# Altium schematic sheet main.schdoc
size B
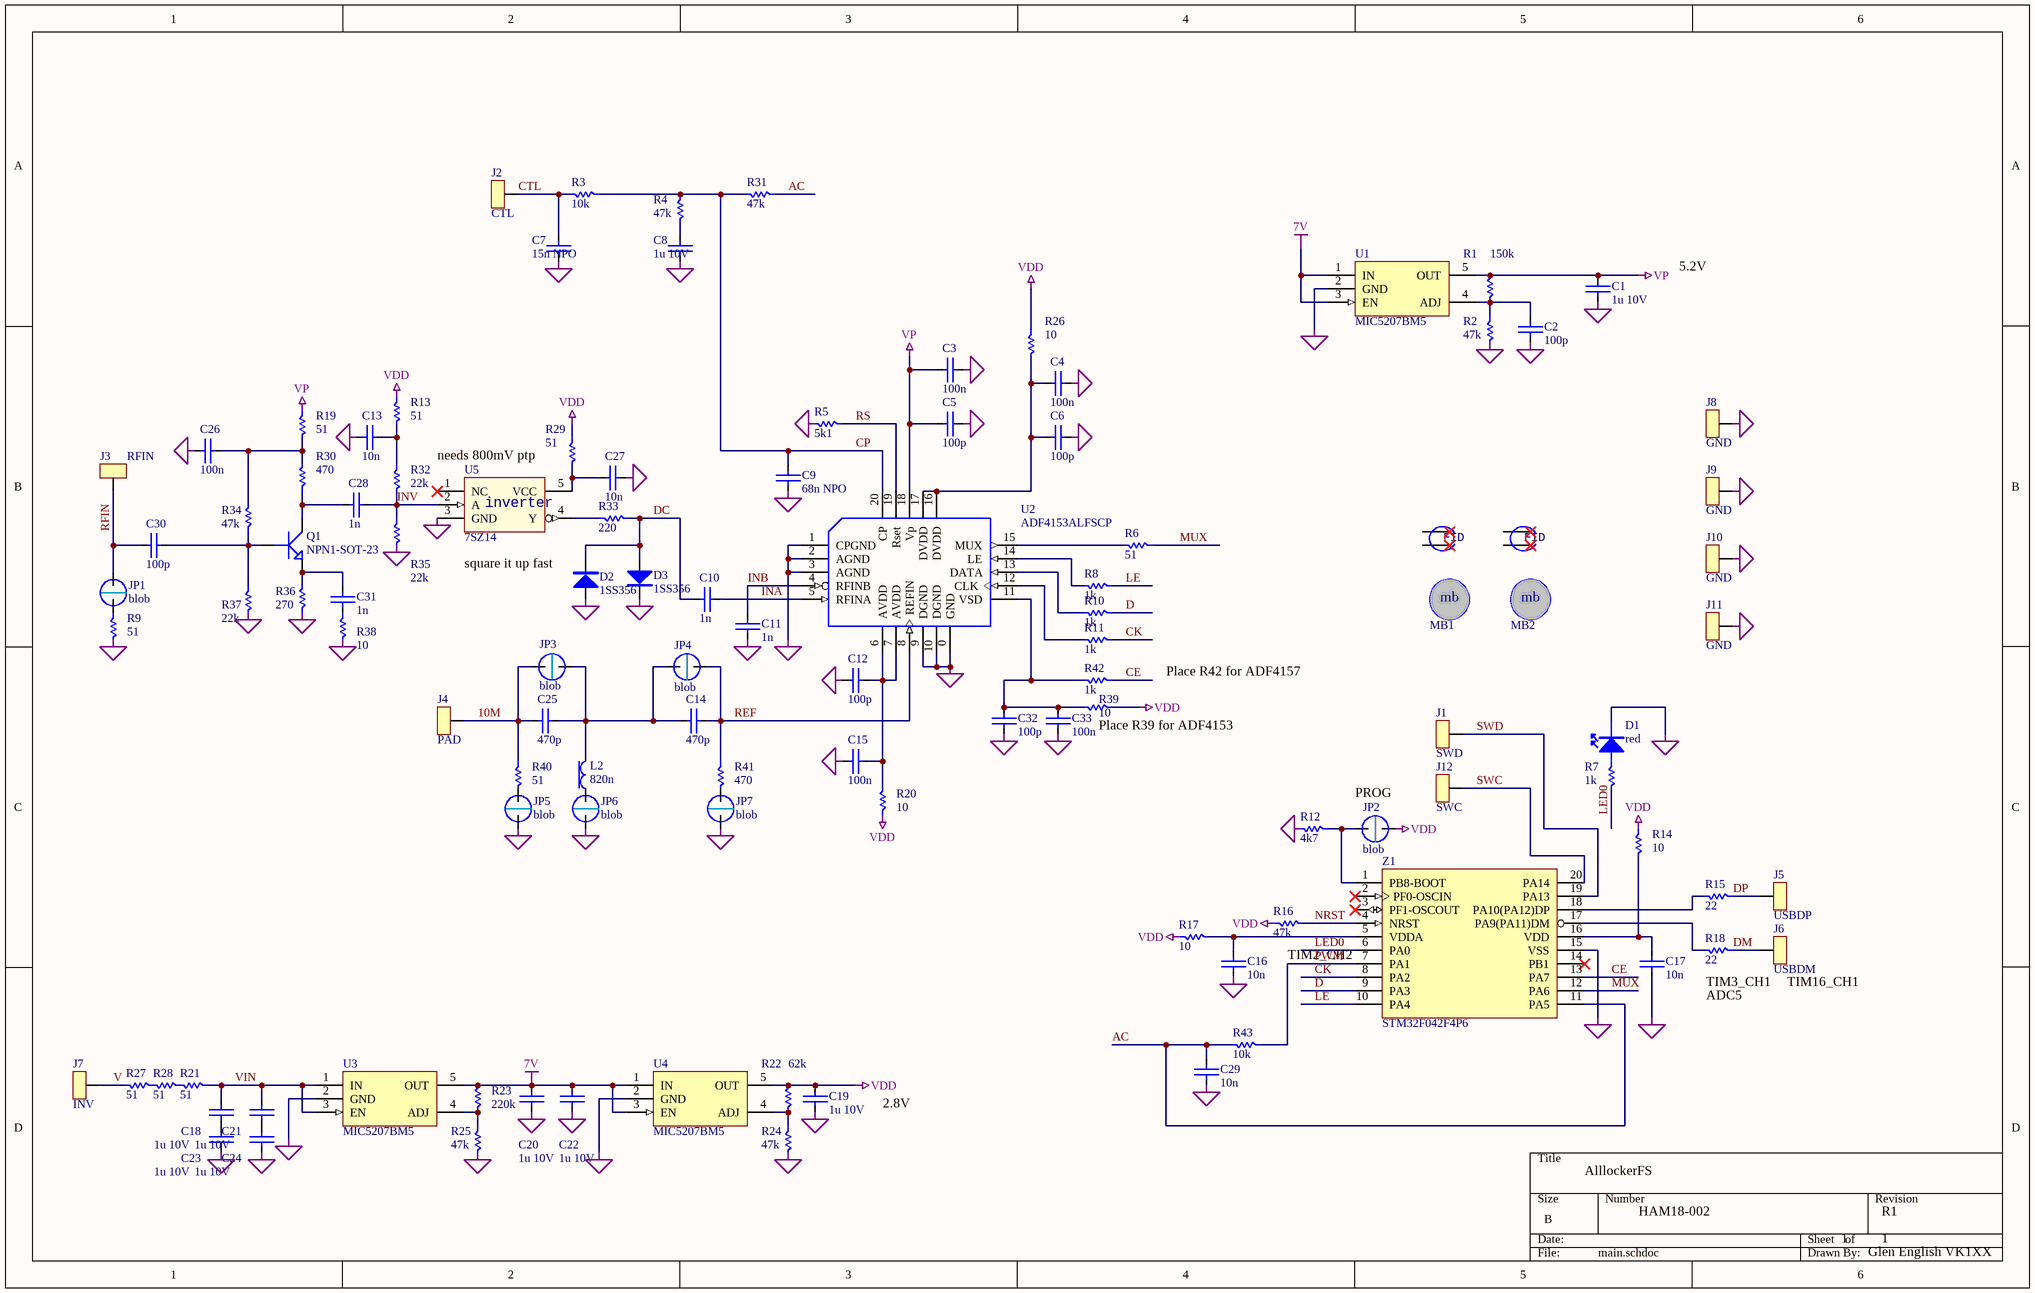
[diagram p0: main.schdoc]

## Parts
C1  1u 10V  [0402C]
C2  100p  [0402C]
C3  100n  [0402C]
C4  100n  [0402C]
C5  100p  [0402C]
C6  100p  [0402C]
C7  15n NPO  [1206C]
C8  1u 10V  [1206C]
C9  68n NPO  [1206C]
C10  1n  [0402C]
C11  1n  [0402C]
C12  100p  [0402C]
C13  10n  [0402C]
C14  470p  [0402C]
C15  100n  [0402C]
C16  10n  [0402C]
C17  10n  [0402C]
C18  1u 10V  [0402C]
C19  1u 10V  [0402C]
C20  1u 10V  [0402C]
C21  1u 10V  [0402C]
C22  1u 10V  [0402C]
C23  1u 10V  [0402C]
C24  1u 10V  [0402C]
C25  470p  [0402C]
C26  100n  [0402C]
C27  10n  [0402C]
C28  1n  [0402C]
C29  10n  [0402C]
C30  100p  [0402C]
C31  1n  [0402C]
C32  100p  [0402C]
C33  100n  [0402C]
D1  red  [0603LED]
D2  1SS356  [SOD323]
D3  1SS356  [SOD323]
FID1  FIDUCIAL  [FIDUCIAL]  (value not drawn)
FID2  FIDUCIAL  [FIDUCIAL]  (value not drawn)
J1  SWD  [TESTPOINT_SMALL]
J2  CTL  [GPPAD3R]
J3  RFIN  [GPPAD3R]
J4  PAD  [GPPAD3R]
J5  USBDP  [GPPAD3R]
J6  USBDM  [GPPAD3R]
J7  INV  [GPPAD3R]
J8  GND  [GPPAD3R]
J9  GND  [GPPAD3R]
J10  GND  [GPPAD3R]
J11  GND  [GPPAD3R]
J12  SWC  [TESTPOINT_SMALL]
JP1  blob  [BLOBJUMPER]
JP2  blob  [BLOBJUMPER]
JP3  blob  [BLOBJUMPER]
JP4  blob  [BLOBJUMPER]
JP5  blob  [BLOBJUMPER]
JP6  blob  [BLOBJUMPER]
JP7  blob  [BLOBJUMPER]
L2  820n  [0603L]
MB1  mousebite  [mousebite]  (value not drawn)
MB2  mousebite  [mousebite]  (value not drawn)
Q1  NPN1-SOT-23  [SOT-323]
R1  150k  [0402R]
R2  47k  [0402R]
R3  10k  [0603R]
R4  47k  [0603R]
R5  5k1  [0402R]
R6  51  [0402R]
R7  1k  [0402R]
R8  1k  [0402R]
R9  51  [0402R]
R10  1k  [0402R]
R11  1k  [0402R]
R12  4k7  [0402R]
R13  51  [0402R]
R14  10  [0402R]
R15  22  [0402R]
R16  47k  [0402R]
R17  10  [0402R]
R18  22  [0402R]
R19  51  [0402R]
R20  10  [0402R]
R21  51  [0402R]
R22  62k  [0402R]
R23  220k  [0402R]
R24  47k  [0402R]
R25  47k  [0402R]
R26  10  [0402R]
R27  51  [0402R]
R28  51  [0402R]
R29  51  [0402R]
R30  470  [0402R]
R31  47k  [0402R]
R32  22k  [0402R]
R33  220  [0402R]
R34  47k  [0402R]
R35  22k  [0402R]
R36  270  [0402R]
R37  22k  [0402R]
R38  10  [0402R]
R39  10  [0402R]
R40  51  [0402R]
R41  470  [0402R]
R42  1k  [0402R]
R43  10k  [0402R]
U1  MIC5207BM5  [SOT23-5]
U2  ADF4153ALFSCP  [ADI-CP-20-6]
U3  MIC5207BM5  [SOT23-5]
U4  MIC5207BM5  [SOT23-5]
U5  7SZ14  [SC70-5]
Z1  STM32F042F4P6  [TSSOP20_4.4mm]

## Nets
7V: C20.1 C22.1 R23.2 U1.1(IN) U1.3(EN) U3.5(OUT) U4.1(IN) U4.3(EN)
GND: C1.2 C2.2 C3.2 C4.2 C5.2 C6.2 C7.2 C8.2 C9.2 C11.2 C12.1 C13.1 C15.1 C16.2 C17.2 C19.2 C20.2 C22.2 C23.2 C24.2 C26.1 C27.2 C29.2 C32.2 C33.2 D1.K D2.A D3.K J8.1(TP) J9.1(TP) J10.1(TP) J11.1(TP) JP5.2 JP6.2 JP7.2 R2.2 R5.2 R9.2 R12.2 R24.2 R25.2 R35.2 R36.1 R37.2 R38.2 U1.2(GND) U2.0(GND) U2.1(CPGND) U2.2(AGND) U2.3(AGND) U2.9(DGND) U2.10(DGND) U3.2(GND) U4.2(GND) U5.3(GND) Z1.15(VSS)
VDD: C19.1 JP2.1 R13.1 R14.1 R16.1 R17.1 R20.1 R22.2 R26.1 R29.1 R39.1 U4.5(OUT)
VP: C1.1 C3.1 C5.1 R1.2 R19.1 U1.5(OUT) U2.18(Vp)
10M: C25.1 J4.1(TP) JP3.1 R40.1
AC: C29.1 R31.1 R43.2 Z1.11(PA5)
CE: R42.1 Z1.13(PA7)
CK: R11.1 Z1.8(PA2)
CP: C9.1 R3.1 R4.1 R31.2 U2.20(CP)
CTL: C7.1 J2.1(TP) R3.2
D: R10.1 Z1.9(PA3)
DC: C10.1 D2.K D3.A R33.2
DM: J6.1(TP) R18.1
DP: J5.1(TP) R15.1
INA: C10.2 U2.5(RFINA)
INB: C11.1 U2.4(RFINB)
INV: C28.2 R32.2 R35.1 U5.2(A)
LE: R8.1 Z1.10(PA4)
LED0: R7.2 Z1.6(PA0)
MUX: R6.1 Z1.12(PA6)
NRST: R16.2 Z1.4(NRST)
PWM: R43.1 Z1.7(PA1)
REF: C14.2 JP4.1 R41.1 U2.8(REFIN)
RFIN: C30.1 J3.1(TP) JP1.1
RS: R5.1 U2.19(Rset)
SWC: J12.1(TP) Z1.20(PA14)
SWD: J1.1(TP) Z1.19(PA13)
V: J7.1(TP) R27.2
VIN: C18.1 C21.1 R21.1 U3.1(IN) U3.3(EN)
NetC2_1: C2.1 R1.1 R2.1 U1.4(ADJ)
NetC4_1: C4.1 C6.1 R26.2 U2.16(DVDD) U2.17(DVDD)
NetC8_1: C8.1 R4.2
NetC12_2: C12.2 C15.2 R20.2 U2.6(AVDD) U2.7(AVDD)
NetC13_2: C13.2 R13.2 R32.1
NetC14_1: C14.1 C25.2 JP3.2 JP4.2 L2.2
NetC16_1: C16.1 R17.2 Z1.5(VDDA)
NetC17_1: C17.1 R14.2 Z1.16(VDD)
NetC18_2: C18.2 C23.1
NetC21_2: C21.2 C24.1
NetC26_2: C26.2 R19.2 R30.2 R34.2
NetC27_1: C27.1 R29.2 U5.5(VCC)
NetC28_1: C28.1 Q1.3(COLLECTOR) R30.1
NetC30_2: C30.2 Q1.1(BASE) R34.1 R37.1
NetC31_1: C31.1 R38.1
NetC31_2: C31.2 Q1.2(EMITTER) R36.2
NetC32_1: C32.1 C33.1 R39.2 R42.2 U2.11(VSD)
NetD1_A: D1.A R7.1
NetJP1_2: JP1.2 R9.1
NetJP2_2: JP2.2 R12.1 Z1.1(PB8-BOOT)
NetJP5_1: JP5.1 R40.2
NetJP6_1: JP6.1 L2.1
NetJP7_1: JP7.1 R41.2
NetR6_2: R6.2 U2.15(MUX)
NetR8_2: R8.2 U2.14(LE)
NetR10_2: R10.2 U2.13(DATA)
NetR11_2: R11.2 U2.12(CLK)
NetR15_2: R15.2 Z1.18(PA10(PA12)DP)
NetR18_2: R18.2 Z1.17(PA9(PA11)DM)
NetR21_2: R21.2 R28.1
NetR22_1: R22.1 R24.1 U4.4(ADJ)
NetR23_1: R23.1 R25.1 U3.4(ADJ)
NetR27_1: R27.1 R28.2
NetR33_1: R33.1 U5.4(Y)

Not connected (* = marked no-connect by the designer): FID1 0* 1*; FID2 0* 1*; U5 1(NC)*; Z1 2(PF0-OSCIN)* 3(PF1-OSCOUT)* 14(PB1)*

## Notes on the sheet
- 5.2V
- needs 800mV ptp
- (near D2) square it up fast
- Place R42 for ADF4157
- (near R39) Place R39 for ADF4153
- PROG
- TIM2_CH2
- ADC5
- TIM3_CH1
- (near J6) TIM16_CH1
- 2.8V
- AlllockerFS
- HAM18-002
- 1
- R1
- Glen English VK1XX
- (in symbol 7SZ04) inverter
- (in symbol FIDUCIAL) FID
- (in symbol mousebite) mb

## Library data of the parts
C1-C12 C14 C15 C18-C25 C28-C33 = caps
C13 C16 C17 C26 C27 = casp
D1 = LEDS
D2 D3 = DIODE-AKPINS_SMALL: diode small
FID1 FID2 = FIDUCIAL: fiducial mark
J1-J12 = TESTPOINT: test point
JP1-JP7 = BLOBJUMPER: blob jumper
L2 = INDSMALL: inductor small
R1-R43 = ress: resistor small
U1 U3 U4 = MIC5207BM5: adjustable low dropout regulator
U2 = ADF4153LFSCP: freq synthesiser
U5 = 7SZ04: tinylogic unbuffer
Z1 = STM32F042x4: STM32 M0 TSSOP